# Altium schematic sheet TMC2209.SchDoc
size A4
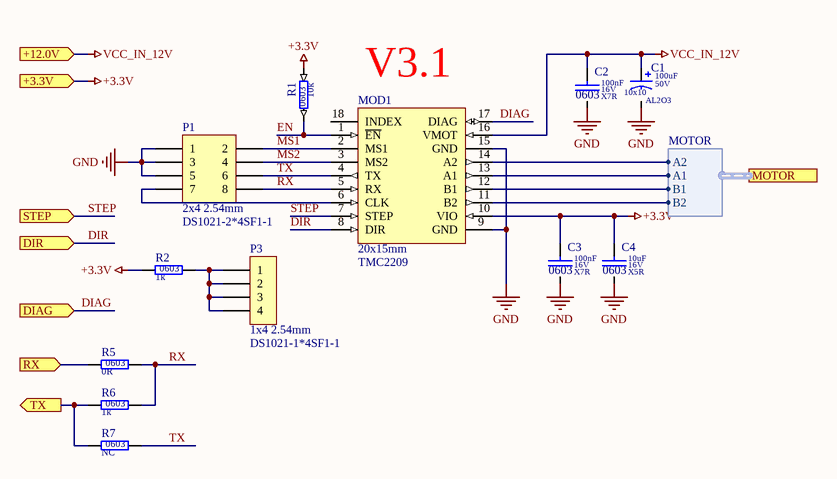
[diagram p0: TMC2209.SchDoc]

## Parts
C1  value 100uF  Dielectric: AL2O3  SCH_Footprint: 10x10  Voltage: 50V  [CE_D_10x10MM]  (hidden comment: Electrolytic Capacitor)
C2  value 100nF  Dielectric: X7R  Voltage: 16V  SCH_Footprint: 0603  [C_0603_1608]  (hidden comment: Ceramic X7R)
C3  value 100nF  Dielectric: X7R  Voltage: 16V  SCH_Footprint: 0603  [C_0603_1608]  (hidden comment: Ceramic X7R)
C4  value 10uF  Dielectric: X5R  Voltage: 16V  SCH_Footprint: 0603  [C_0603_1608]  (hidden comment: Ceramic X5R)
MOD1  value TMC2209  SCH_Footprint: 20x15mm  [MOD_TMC2209]  (hidden comment: The TMC2209 is an ultra-silent motor driver IC for two phase stepper motors.)
P1  value DS1021-2*4SF1-1  SCH_Footprint: 2x4 2.54mm  [P_HEADER_2x4_2.54]  (hidden comment: Goldpin male)
P3  value DS1021-1*4SF1-1  SCH_Footprint: 1x4 2.54mm  [P_HEADER_1x4_2.54]  (hidden comment: Goldpin)
R1  value 10k  SCH_Footprint: 0603  [R_0603_1608]  (hidden comment: Resistor)
R2  value 1k  SCH_Footprint: 0603  [R_0603_1608]  (hidden comment: Resistor)
R5  value 0R  SCH_Footprint: 0603  [R_0603_1608]  (hidden comment: Resistor)
R6  value 1k  SCH_Footprint: 0603  [R_0603_1608]  (hidden comment: Resistor)
R7  value NC  SCH_Footprint: 0603  [R_NC_0603_1608]  (hidden comment: Resistor)

## Ports
+3.3V (in), +12.0V (in), DIAG (in), DIR (in), MOTOR (harness MOTOR), RX (in), STEP (in), TX (out)

## Harnesses
MOTOR: A2, A1, B1, B2

## Nets
+3.3V: C3.1 C4.1 MOD1.10(VIO) R1.1 R2.1 ; port +3.3V
GND: C1.2 C2.2 C3.2 C4.2 MOD1.9(GND) MOD1.15(GND) P1.1 P1.3 P1.5
VCC_IN_12V: C1.1 C2.1 MOD1.16(VMOT) ; port +12.0V
DIAG: MOD1.17(DIAG) ; port DIAG
DIR: MOD1.8(DIR) ; port DIR
EN: MOD1.1(~{EN}) R1.2
MS1: MOD1.2(MS1) P1.2
MS2: MOD1.3(MS2) P1.4
RX: MOD1.5(RX) P1.8 R5.2 R6.2
RX: R5.1 ; port RX  [a separate net that carries the same name]
STEP: MOD1.7(STEP) ; port STEP
TX: MOD1.4(TX) P1.6 R7.2
TX: R6.1 R7.1 ; port TX  [a separate net that carries the same name]
NetMOD1_6: MOD1.6(CLK) P1.7
NetMOD1_11: MOD1.11(B2) ; port MOTOR.B2
NetMOD1_12: MOD1.12(B1) ; port MOTOR.B1
NetMOD1_13: MOD1.13(A1) ; port MOTOR.A1
NetMOD1_14: MOD1.14(A2) ; port MOTOR.A2
NetP3_1: P3.1 P3.2 P3.3 P3.4 R2.2

Not connected (* = marked no-connect by the designer): MOD1 18(INDEX)

## Notes on the sheet
- (near MOD1) V3.1

## Library data of the parts
C1 = CE_100uF_50V_AL2O3_10x10_20: Polarized Capacitor; Manufacturer: Nichicon; Manufacturer Part Number: UUX1H101MNL1GS; Tolerance (%): 20; Part Number: CE_100uF_50V_AL2O3_10x10_20; HelpURL: https://datasheet.octopart.com/UUX1H101MNL1GS-Nichicon-datasheet-62047998.pdf; Supplier 1: TME; Supplier Part Number 1: UUX1H101MNL1GS; Supplier 2: RS Components; Supplier Part Number 2: 739-3107; Supplier 3: Farnell; Supplier Part Number 3: 2841943; Supplier 4: Mouser; Supplier Part Number 4: 647-UUX1H101MNL1GS; Supplier 5: Digi-Key; Supplier Part Number 5: 493-6269-1-ND; Supplier 6: LCSC
C2 C3 = C_100nF_16V_X7R_0603_10: Capacitor; Manufacturer: Kemet; Manufacturer Part Number: C0603C104K4RAC7013; Tolerance (%): 10; Part Number: C_100nF_16V_X7R_0603_10; HelpURL: https://pl.mouser.com/datasheet/2/212/KEM_C1002_X7R_SMD-1102033.pdf; Supplier 1: TME; Supplier 2: RS Components; Supplier 3: Farnell; Supplier 4: Mouser; Supplier Part Number 4: 80-C0603C104K4RC7013; Supplier 5: Digi-Key; Supplier Part Number 5: 399-7372-2-ND; Supplier 6: LCSC
C4 = C_10uF_16V_X5R_0603_20: Capacitor; Manufacturer: Samsung Electro-Mechanics; Manufacturer Part Number: CL10A106MO8NQNC; Tolerance (%): 20; Part Number: C_10uF_16V_X5R_0603_20; HelpURL: http://www.tme.eu/pl/Document/4a42202b32dab16128fe107dd69598cc/samsung-chip-cap.pdf; Supplier 1: TME; Supplier Part Number 1: CL10A106MO8NQNC; Supplier 2: RS Components; Supplier 3: Farnell; Supplier 4: Mouser; Supplier 5: Digi-Key; Supplier 6: LCSC
MOD1 = MOD_TMC2209: Manufacturer: Trinamic; Part Number: MOD_TMC2209; HelpURL: https://www.trinamic.com/fileadmin/assets/Products/ICs_Documents/TMC2209_Datasheet_V103.pdf; Manufacturer Part Number: TMC2209; Supplier 1: TME; Supplier 2: RS Components; Supplier 3: Farnell; Supplier Part Number 3: 3131532; Supplier 4: Mouser; Supplier Part Number 4: 700-TMC2209SILENTSTE; Supplier 5: Digi-Key; Supplier Part Number 5: 1460-1395-ND; Supplier 6: LCSC
P1 = P_HEADER_2x4_2.54: Pin Header; Manufacturer: Connfly; Part Number: P_HEADER_2x4_2.54; HelpURL: https://www.tme.eu/Document/cc301e58a5da78cb543a94b5a5b7f06a/DS1021.pdf; Manufacturer Part Number: DS1021-2*4SF1-1; Supplier 1: TME; Supplier Part Number 1: ZL202-8G; Supplier 2: RS Components; Supplier 3: Farnell; Supplier 4: Mouser; Supplier 5: Digi-Key; Supplier 6: LCSC
P3 = P_HEADER_1x4_2.54: Pin Header; Manufacturer: Connfly; Part Number: P_HEADER_1x4_2.54; HelpURL: http://datasheet.octopart.com/DS1021-1%2A4SF1-1-Connfly-datasheet-65537859.pdf; Manufacturer Part Number: DS1021-1*4SF1-1; Supplier 1: TME; Supplier Part Number 1: ZL201-04G; Supplier 2: RS Components; Supplier 3: Farnell; Supplier 4: Mouser; Supplier 5: Digi-Key; Supplier 6: LCSC
R1 = R_10k_0603_1: Manufacturer: Vishay; Manufacturer Part Number: CRCW060310K0FKTABC; Voltage: 75V; Power: 100mW; Tolerance: 1%; Part Number: R_10k_0603_1; HelpURL: http://www.tme.eu/pl/Document/622e28308c06d160637f2b14751ba16b/Data%20Sheet%20CRCW_BCe3.pdf; Supplier 1: TME; Supplier Part Number 1: CRCW060310K0FKTABC; Supplier 2: RS Components; Supplier 3: Farnell; Supplier 4: Mouser; Supplier Part Number 4: 667-ERJ-3EKF1002V; Supplier 5: Digi-Key; Supplier Part Number 5: P10KGCT-ND; Supplier 6: LCSC
R2 R6 = R_1k_0603_1: Manufacturer: Vishay; Manufacturer Part Number: CRCW06031K00FKEA; Voltage: 75V; Power: 100mW; Tolerance: 1%; Part Number: R_1k_0603_1; HelpURL: http://www.farnell.com/datasheets/2310790.pdf?_ga=2.256888843.1690599162.1548417389-1379097396.1542296996&_gac=1.262631934.1547230258.Cj0KCQiAmuHhBRD0ARIsAFWyPwhX8HcvXnM3tA0ZBodZLzDIjH2ZxLpjT5LWo9bad_HPRbU8LfPq44UaAhEwEALw_wcB; Supplier 1: TME; Supplier 2: RS Components; Supplier Part Number 2: 678-9875P; Supplier 3: Farnell; Supplier Part Number 3: 1469740; Supplier 4: Mouser; Supplier Part Number 4: 71-CRCW0603-1.0K-E3; Supplier 5: Digi-Key; Supplier Part Number 5: 541-1.00KHCT-ND; Supplier 6: LCSC
R5 = R_0R_0603_1: Manufacturer: Yageo; Manufacturer Part Number: RC0603FR-070RL; Voltage: 75V; Power: 100mW; Tolerance: 1%; Part Number: R_0R_0603_1; HelpURL: https://datasheet.octopart.com/RC0603FR-070RL-Yageo-datasheet-8328172.pdf; Supplier 1: TME; Supplier Part Number 1: RC0603FR-070RL; Supplier 2: RS Components; Supplier 3: Farnell; Supplier Part Number 3: 2309106; Supplier 4: Mouser; Supplier Part Number 4: 603-RC0603FR-070RL; Supplier 5: Digi-Key; Supplier Part Number 5: 311-0.0HRCT-ND; Supplier 6: LCSC; Supplier Part Number 6: C100044
R7 = R_GENERIC_0603: Part Number: R_GENERIC_0603; Supplier 1: TME; Supplier 2: RS Components; Supplier 3: Farnell; Supplier 4: Mouser; Supplier 5: Digi-Key; Supplier 6: LCSC